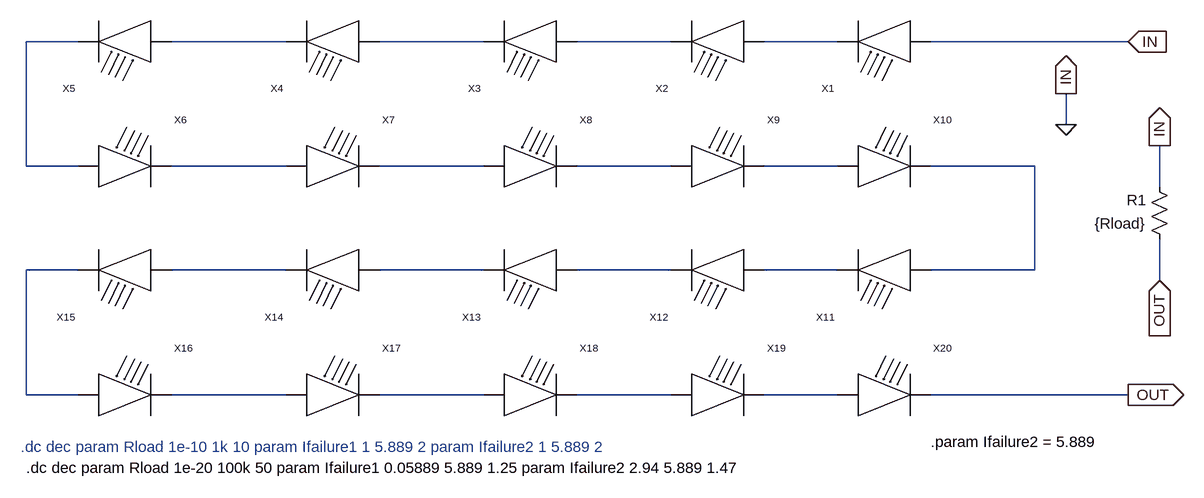
[diagram p0: schematic string.asc]
string.asc, the LTspice schematic file:
Version 4
SHEET 1 1588 680
WIRE -1056 -304 -1136 -304
WIRE -736 -304 -912 -304
WIRE -432 -304 -592 -304
WIRE -144 -304 -288 -304
WIRE 112 -304 0 -304
WIRE 560 -304 256 -304
WIRE 464 -176 464 -224
WIRE -1136 -112 -1136 -304
WIRE -1056 -112 -1136 -112
WIRE -736 -112 -912 -112
WIRE -432 -112 -592 -112
WIRE -144 -112 -288 -112
WIRE 112 -112 0 -112
WIRE 416 -112 256 -112
WIRE 608 -80 608 -144
WIRE -1056 48 -1136 48
WIRE -736 48 -912 48
WIRE -432 48 -592 48
WIRE -144 48 -288 48
WIRE 112 48 0 48
WIRE 416 48 416 -112
WIRE 416 48 256 48
WIRE 608 64 608 0
WIRE -1136 240 -1136 48
WIRE -1056 240 -1136 240
WIRE -736 240 -912 240
WIRE -432 240 -592 240
WIRE -144 240 -288 240
WIRE 112 240 0 240
WIRE 560 240 256 240
FLAG 560 -304 IN
IOPIN 560 -304 In
FLAG 560 240 OUT
IOPIN 560 240 Out
FLAG 608 -144 IN
IOPIN 608 -144 Out
FLAG 608 64 OUT
IOPIN 608 64 In
FLAG 464 -224 IN
IOPIN 464 -224 Out
FLAG 464 -176 0
SYMBOL res 624 16 R180
WINDOW 0 36 76 Left 2
WINDOW 3 36 40 Left 2
SYMATTR InstName R1
SYMATTR Value {Rload}
SYMBOL jacModule 192 -304 R180
SYMATTR InstName X1
SYMATTR SpiceLine Ifail = {Ifailure1}
SYMBOL jacModule -64 -304 R180
SYMATTR InstName X2
SYMATTR SpiceLine Ifail = {Ifailure2}
SYMBOL jacModule -352 -304 R180
SYMATTR InstName X3
SYMBOL jacModule -656 -304 R180
SYMATTR InstName X4
SYMBOL jacModule -976 -304 R180
SYMATTR InstName X5
SYMBOL jacModule -992 -112 R0
SYMATTR InstName X6
SYMBOL jacModule -672 -112 R0
SYMATTR InstName X7
SYMBOL jacModule -368 -112 R0
SYMATTR InstName X8
SYMBOL jacModule -80 -112 R0
SYMATTR InstName X9
SYMBOL jacModule 176 -112 R0
SYMATTR InstName X10
SYMBOL jacModule 192 48 R180
SYMATTR InstName X11
SYMBOL jacModule -64 48 R180
SYMATTR InstName X12
SYMBOL jacModule -352 48 R180
SYMATTR InstName X13
SYMBOL jacModule -656 48 R180
SYMATTR InstName X14
SYMBOL jacModule -976 48 R180
SYMATTR InstName X15
SYMBOL jacModule -992 240 R0
SYMATTR InstName X16
SYMBOL jacModule -672 240 R0
SYMATTR InstName X17
SYMBOL jacModule -368 240 R0
SYMATTR InstName X18
SYMBOL jacModule -80 240 R0
SYMATTR InstName X19
SYMBOL jacModule 176 240 R0
SYMATTR InstName X20
TEXT -1144 320 Left 2 ;.dc dec param Rload 1e-10 1k 10 param Ifailure1 1 5.889 2 param Ifailure2 1 5.889 2
TEXT -1136 352 Left 2 !.dc dec param Rload 1e-20 100k 50 param Ifailure1 0.05889 5.889 1.25 param Ifailure2 2.94 5.889 1.47
TEXT 256 312 Left 2 !.param Ifailure2 = 5.889

The netlist it stands for:
* string.asc
R1 OUT 0 {Rload}
XX1 0 N005 jacModule params: Ifail = {Ifailure1}  ; pins modIN modOUT
XX2 N005 N004 jacModule params: Ifail = {Ifailure2}  ; pins modIN modOUT
XX3 N004 N003 jacModule  ; pins modIN modOUT
XX4 N003 N002 jacModule  ; pins modIN modOUT
XX5 N002 N001 jacModule  ; pins modIN modOUT
XX6 N001 N006 jacModule  ; pins modIN modOUT
XX7 N006 N007 jacModule  ; pins modIN modOUT
XX8 N007 N008 jacModule  ; pins modIN modOUT
XX9 N008 N009 jacModule  ; pins modIN modOUT
XX10 N009 N010 jacModule  ; pins modIN modOUT
XX11 N010 N015 jacModule  ; pins modIN modOUT
XX12 N015 N014 jacModule  ; pins modIN modOUT
XX13 N014 N013 jacModule  ; pins modIN modOUT
XX14 N013 N012 jacModule  ; pins modIN modOUT
XX15 N012 N011 jacModule  ; pins modIN modOUT
XX16 N011 N016 jacModule  ; pins modIN modOUT
XX17 N016 N017 jacModule  ; pins modIN modOUT
XX18 N017 N018 jacModule  ; pins modIN modOUT
XX19 N018 N019 jacModule  ; pins modIN modOUT
XX20 N019 OUT jacModule  ; pins modIN modOUT
* .dc dec param Rload 1e-10 1k 10 param Ifailure1 1 5.889 2 param Ifailure2 1 5.889 2
.dc dec param Rload 1e-20 100k 50 param Ifailure1 0.05889 5.889 1.25 param Ifailure2 2.94 5.889 1.47
.param Ifailure2 = 5.889
.backanno
.end